# EasyEDA schematic 1-Schematic_UA741.json
TITLE: Sheet_1; REV: 1.0; Date: 2022-01-29; Sheet: 1/1; Drawn By: king13478509115; Company: Your Company
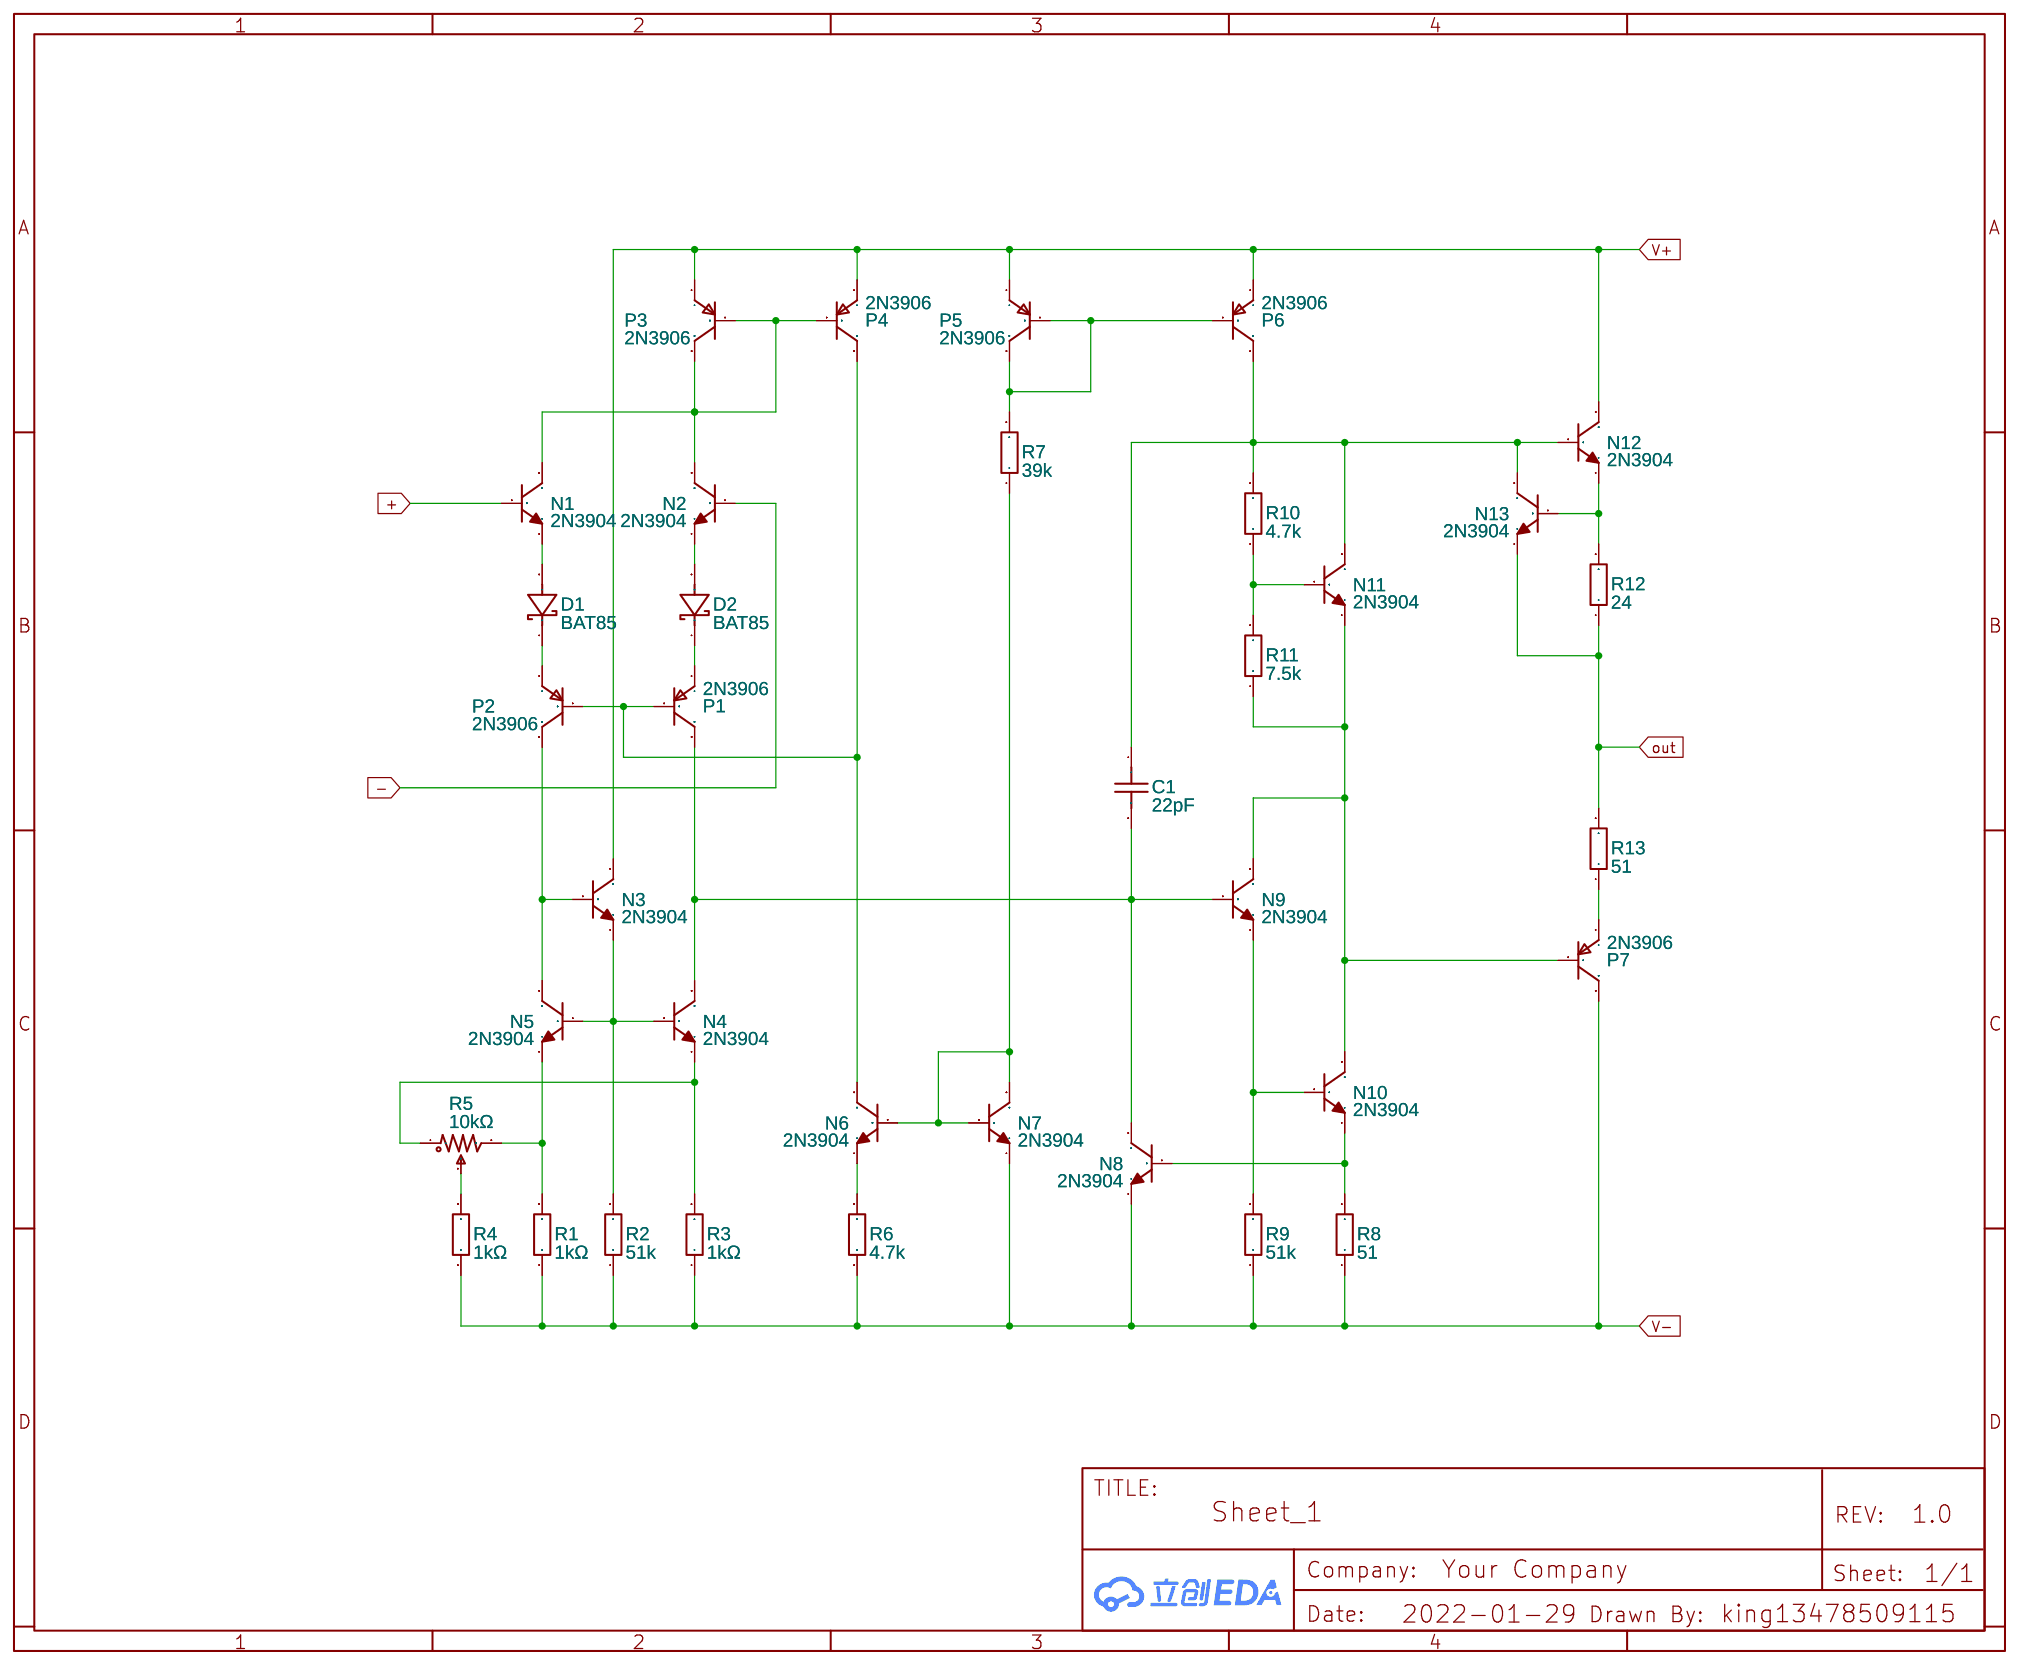
[diagram p0: schematic sheet]

## Parts
C1  22pF  [C0805]
D1  BAT85  [DO-34_BD1.6-L3.0-P7.00-D0.6-RD]
D2  BAT85  [DO-34_BD1.6-L3.0-P7.00-D0.6-RD]
N1  2N3904  [TO-92-3_L5.1-W4.1-P1.27-L]
N2  2N3904  [TO-92-3_L5.1-W4.1-P1.27-L]
N3  2N3904  [TO-92-3_L5.1-W4.1-P1.27-L]
N4  2N3904  [TO-92-3_L5.1-W4.1-P1.27-L]
N5  2N3904  [TO-92-3_L5.1-W4.1-P1.27-L]
N6  2N3904  [TO-92-3_L5.1-W4.1-P1.27-L]
N7  2N3904  [TO-92-3_L5.1-W4.1-P1.27-L]
N8  2N3904  [TO-92-3_L5.1-W4.1-P1.27-L]
N9  2N3904  [TO-92-3_L5.1-W4.1-P1.27-L]
N10  2N3904  [TO-92-3_L5.1-W4.1-P1.27-L]
N11  2N3904  [TO-92-3_L5.1-W4.1-P1.27-L]
N12  2N3904  [TO-92-3_L5.1-W4.1-P1.27-L]
N13  2N3904  [TO-92-3_L5.1-W4.1-P1.27-L]
P1  2N3906  [TO-92-3_L4.9-W3.7-P1.27-L]
P2  2N3906  [TO-92-3_L4.9-W3.7-P1.27-L]
P3  2N3906  [TO-92-3_L4.9-W3.7-P1.27-L]
P4  2N3906  [TO-92-3_L4.9-W3.7-P1.27-L]
P5  2N3906  [TO-92-3_L4.9-W3.7-P1.27-L]
P6  2N3906  [TO-92-3_L4.9-W3.7-P1.27-L]
P7  2N3906  [TO-92-3_L4.9-W3.7-P1.27-L]
R1  1kΩ  [R0805]
R2  51k  [R0805]
R3  1kΩ  [R0805]
R4  1kΩ  [R0805]
R5  10kΩ  [RES-ADJ-TH_3P-L10.0-W10.0-P2.50-L]
R6  4.7k  [R0805]
R7  39k  [R0805]
R8  51  [R0805]
R9  51k  [R0805]
R10  4.7k  [R0805]
R11  7.5k  [R0805]
R12  24  [R0805]
R13  51  [R0805]

## Library data of the parts
C1 = 0805CG220J101NT: Supplier: LCSC; Manufacturer: FH; Contributor: LCSC; Supplier Part: C157623; JLCPCB Part Class: Extended Part
D1 D2 = BAT85,113: Supplier: LCSC; Supplier Part: C549292; Manufacturer: Nexperia; Contributor: LCSC; JLCPCB Part Class: Extended Part
N1-N13 = 2N3904: Supplier: LCSC; Manufacturer: SEMTECH; Supplier Part: C118538; JLCPCB Part Class: Extended Part
P1-P7 = 2N3906_C713606: Supplier: LCSC; Supplier Part: C713606; Manufacturer: LGE; Contributor: LCSC; JLCPCB Part Class: Extended Part
R1-R4 R6-R13 = QR0805F1KP05: Supplier: LCSC; Supplier Part: C176197; Manufacturer: Ever Ohms Tech; Resistance (Ohms): 1K; Contributor: LCSC; JLCPCB Part Class: Extended Part
R5 = 3296W-1-103: Supplier: LCSC; Supplier Part: C118954; Manufacturer: Chengdu Guosheng Tech; Resistance(Ohms): 10K; Contributor: LCSC; Resistance (Ohms): 10K; JLCPCB Part Class: Extended Part

## Nets
+: N1.2(B)
-: N2.2(B)
out: N13.1(E) R12.1 R13.2
V+: N3.3(C) N12.3(C) P3.1(E) P4.1(E) P5.1(E) P6.1(E)
V-: N7.1(E) N8.1(E) P7.3(C) R1.1 R2.1 R3.1 R4.1 R6.1 R8.1 R9.1
Net-(C1-1): C1.1 N11.3(C) N12.2(B) N13.3(C) P6.3(C) R10.2
Net-(C1-2): C1.2 N4.3(C) N8.3(C) N9.2(B) P1.3(C)
Net-(D1-1): D1.1(K) P2.1(E)
Net-(D1-2): D1.2(A) N1.1(E)
Net-(D2-1): D2.1(K) P1.1(E)
Net-(D2-2): D2.2(A) N2.1(E)
Net-(N1-3): N1.3(C) N2.3(C) P3.2(B) P3.3(C) P4.2(B)
Net-(N3-1): N3.1(E) N4.2(B) N5.2(B) R2.2
Net-(N3-2): N3.2(B) N5.3(C) P2.3(C)
Net-(N4-1): N4.1(E) R3.2 R5.1
Net-(N5-1): N5.1(E) R1.2 R5.3
Net-(N6-1): N6.1(E) R6.2
Net-(N6-2): N6.2(B) N7.2(B) N7.3(C) R7.1
Net-(N6-3): N6.3(C) P1.2(B) P2.2(B) P4.3(C)
Net-(N8-2): N8.2(B) N10.1(E) R8.2
Net-(N9-1): N9.1(E) N10.2(B) R9.2
Net-(N9-3): N9.3(C) N10.3(C) N11.1(E) P7.2(B) R11.1
Net-(N11-2): N11.2(B) R10.1 R11.2
Net-(N12-1): N12.1(E) N13.2(B) R12.2
Net-(P5-2): P5.2(B) P5.3(C) P6.2(B) R7.2
Net-(P7-1): P7.1(E) R13.1
Net-(R4-2): R4.2 R5.2
